# EAGLE schematic ramanSpectrometer_electronic_controlBoard_easy (EAGLE 6.2)
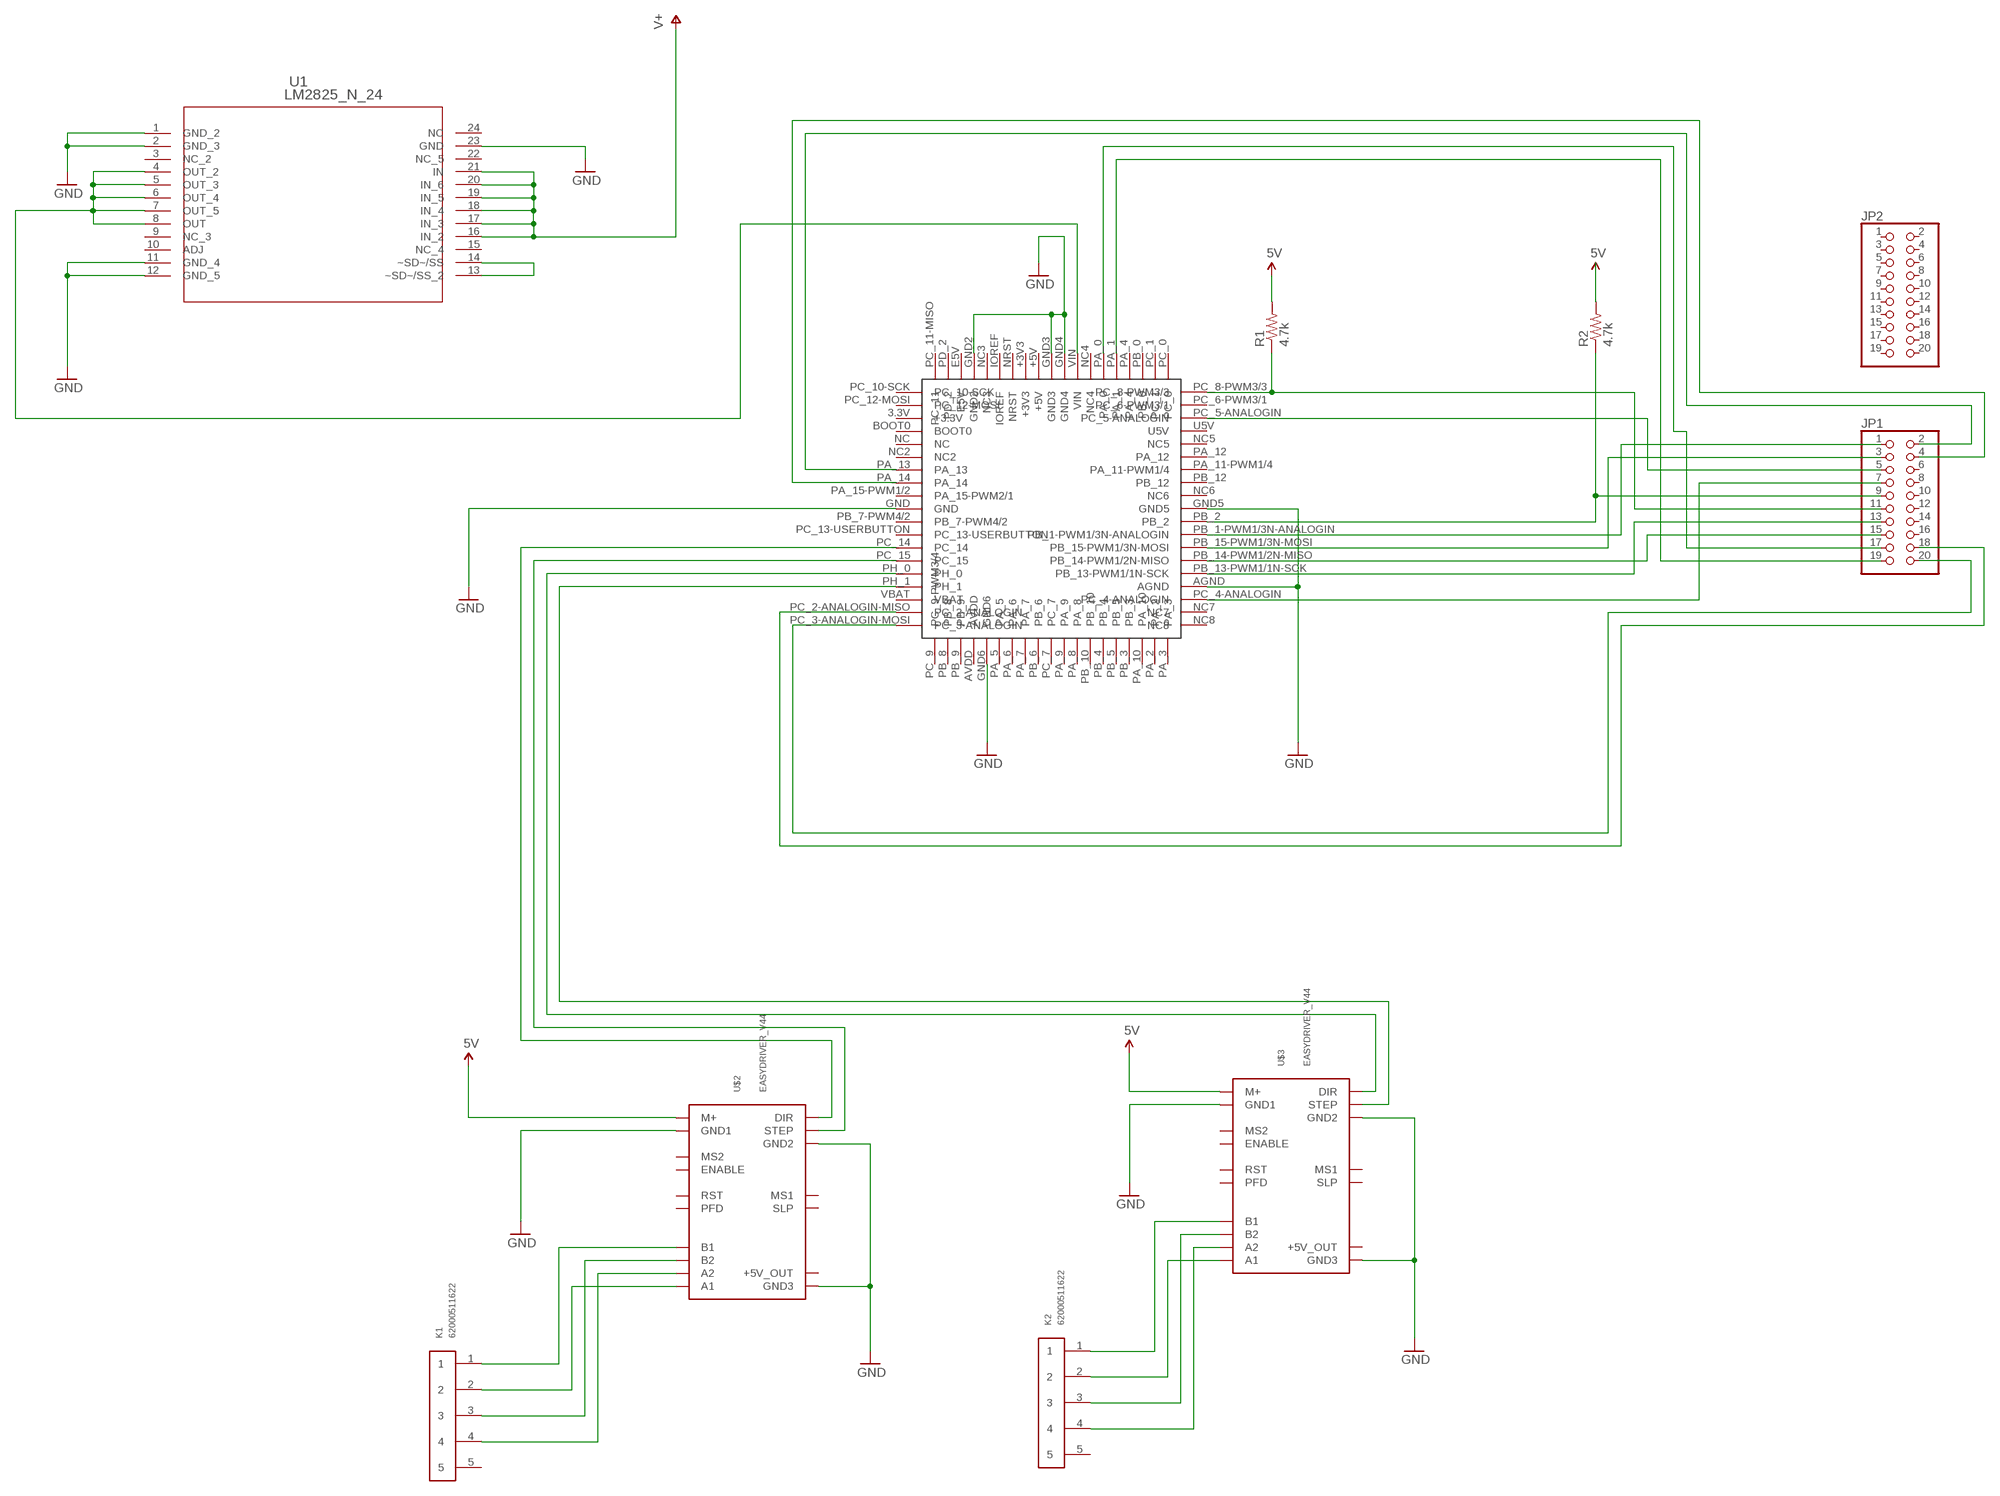
[diagram p0: schematic, sheet 1]

## Parts
JP1  PINHD-2X10  [2X10]
JP2  PINHD-2X10  [2X10]
K1  62000511622  [62000511622]
K2  62000511622  [62000511622]
R1  4.7k  RESISTORKIT  [AXIAL-0.3-KIT]
R2  4.7k  RESISTORKIT  [AXIAL-0.3-KIT]
U1  LM2825_N_24  [NA24F]
U$1  STNUCLEOF401RE  [F401-RE]
U$2  EASYDRIVER_V44  [EASYDRIVER_V44]
U$3  EASYDRIVER_V44  [EASYDRIVER_V44]

## Nets
5V: R1.P$2 R2.P$2 U$2.M+ U$3.M+
5V_LOGIC: U1.4(OUT_2) U1.5(OUT_3) U1.6(OUT_4) U1.7(OUT_5) U1.8(OUT) U$1.VIN
CUVETTE_HBRDG_1: JP1.13 U$1.PB_13-PWM1/1N-SCK
CUVETTE_HBRDG_2: JP1.15 U$1.PB_14-PWM1/2N-MISO
CUVETTE_INSERT_GOOD: JP1.18 U$1.PC_2-ANALOGIN-MISO(PC_2-ANALOGIN)
CUVETTE_PELT_CURRENT: JP1.7 U$1.PC_4-ANALOGIN
CUVETTE_TEMP: JP1.11 R1.P$1 U$1.PC_8-PWM3/3
CUVETTE_TRAY_OPTO1: JP1.4 U$1.PA_14
CUVETTE_TRAY_OPTO2: JP1.2 U$1.PA_13
GND: U1.1(GND_2) U1.2(GND_3) U1.11(GND_4) U1.12(GND_5) U1.23(GND) U$1.AGND U$1.GND U$1.GND2 U$1.GND3 U$1.GND4 U$1.GND5 U$1.GND6 U$2.GND1 U$2.GND2 U$2.GND3 U$3.GND1 U$3.GND2 U$3.GND3
IMAGER_HBRDG_1: JP1.3 U$1.PB_15-PWM1/3N-MOSI
IMAGER_HBRDG_2: JP1.1 U$1.PB_1-PWM1/3N-ANALOGIN
IMAGER_PELT_CURRENT: JP1.5 U$1.PC_5-ANALOGIN
LASER_OPTO_GOOD: JP1.20 U$1.PC_3-ANALOGIN-MOSI(PC_3-ANALOGIN)
LASER_RELAY: JP1.19 U$1.PA_1
LASER_TEMP: JP1.9 R2.P$1 U$1.PB_2
LASER_TTL: JP1.17 U$1.PA_0
N$1: U$1.PC_14 U$2.DIR
N$2: U$1.PC_15 U$2.STEP
N$3: U$1.PH_0 U$3.DIR
N$4: U$1.PH_1 U$3.STEP
N$5: K1.1 U$2.B1
N$6: K1.2 U$2.A1
N$7: K1.3 U$2.B2
N$8: K1.4 U$2.A2
N$9: K2.1 U$3.B1
N$10: K2.2 U$3.A1
N$11: K2.3 U$3.B2
N$12: K2.4 U$3.A2
N$20: U1.13(~SD~/SS_2) U1.14(~SD~/SS)
V+: U1.16(IN_2) U1.17(IN_3) U1.18(IN_4) U1.19(IN_5) U1.20(IN_6) U1.21(IN)
Unconnected: JP1.6 JP1.8 JP1.10 JP1.12 JP1.14 JP1.16 JP2.1 JP2.2 JP2.3 JP2.4 JP2.5 JP2.6 JP2.7 JP2.8 JP2.9 JP2.10 JP2.11 JP2.12 JP2.13 JP2.14 JP2.15 JP2.16 JP2.17 JP2.18 JP2.19 JP2.20 K1.5 K2.5 U1.3(NC_2) U1.9(NC_3) U1.10(ADJ) U1.15(NC_4) U1.22(NC_5) U1.24(NC) U$1.+3V3 U$1.+5V U$1.BOOT0 U$1.IOREF U$1.NC U$1.NC2 U$1.NC3 U$1.NC4 U$1.NC5 U$1.NC7 U$1.NC8 U$1.NRST U$1.PA_2 U$1.PA_3 U$1.PA_4 U$1.PA_5 U$1.PA_6 U$1.PA_7 U$1.PA_8 U$1.PA_9 U$1.PA_10 U$1.PA_11-PWM1/4 U$1.PA_12 U$1.PA_15-PWM1/2(PA_15-PWM2/1) U$1.PB_0 U$1.PB_3 U$1.PB_4 U$1.PB_5 U$1.PB_6 U$1.PB_7-PWM4/2 U$1.PB_8 U$1.PB_9 U$1.PB_10 U$1.PB_12 U$1.PC_0 U$1.PC_1 U$1.PC_6-PWM3/1 U$1.PC_7 U$1.PC_9(PC_9-PWM3/4) U$1.PC_10-SCK U$1.PC_11-MISO(PC_11) U$1.PC_12-MOSI U$1.PC_13-USERBUTTON U$1.PD_2 U$1.U5V U$2.ENABLE U$2.MS1 U$2.MS2 U$2.P$11(+5V_OUT) U$2.PFD U$2.RST U$2.SLEEP(SLP) U$3.ENABLE U$3.MS1 U$3.MS2 U$3.P$11(+5V_OUT) U$3.PFD U$3.RST U$3.SLEEP(SLP)

## Power pins joined to a net without a drawn wire
+3.3V: U$1.3.3V(+3.3V)
AVDD: U$1.AVDD
E5V: U$1.E5V
NC6: U$1.NC6
VBAT: U$1.VBAT

## Library data of the parts
JP1 JP2 = SparkFun-Connectors:PINHD-2X10: PIN HEADER
K1 K2 = Wuerth_Elektronik_eiCan_Wire_to_Board_Connectors:62000511622: WR-WTB 2.00mm Male Vertical Shrouded Header, 5 Pins
R1 R2 = SparkFun-Passives:RESISTOR: Resistor Basic schematic elements and footprints for 0603, 1206, and PTH resistors.
U1 = lm2825:LM2825_N_24; BASE_PN: LM2825; COMPTYPE: Switcher; PARTNUMBER: LM2825HN-ADJ; SYMBOL: NameLM2825HN-ADJ; TYPE: LM2825HN-ADJ; VENDOR: NationalSemiconductor; VERSION: 05/02/2007
U$1 = nucleoF401RE:STNUCLEOF401RE
U$2 U$3 = EasyDriver:EASYDRIVER_V44: EasyDriver version 4.4 - http://www.schmalzhaus.com/EasyDriver